# EAGLE schematic 258Verbos (EAGLE 7.5.0)
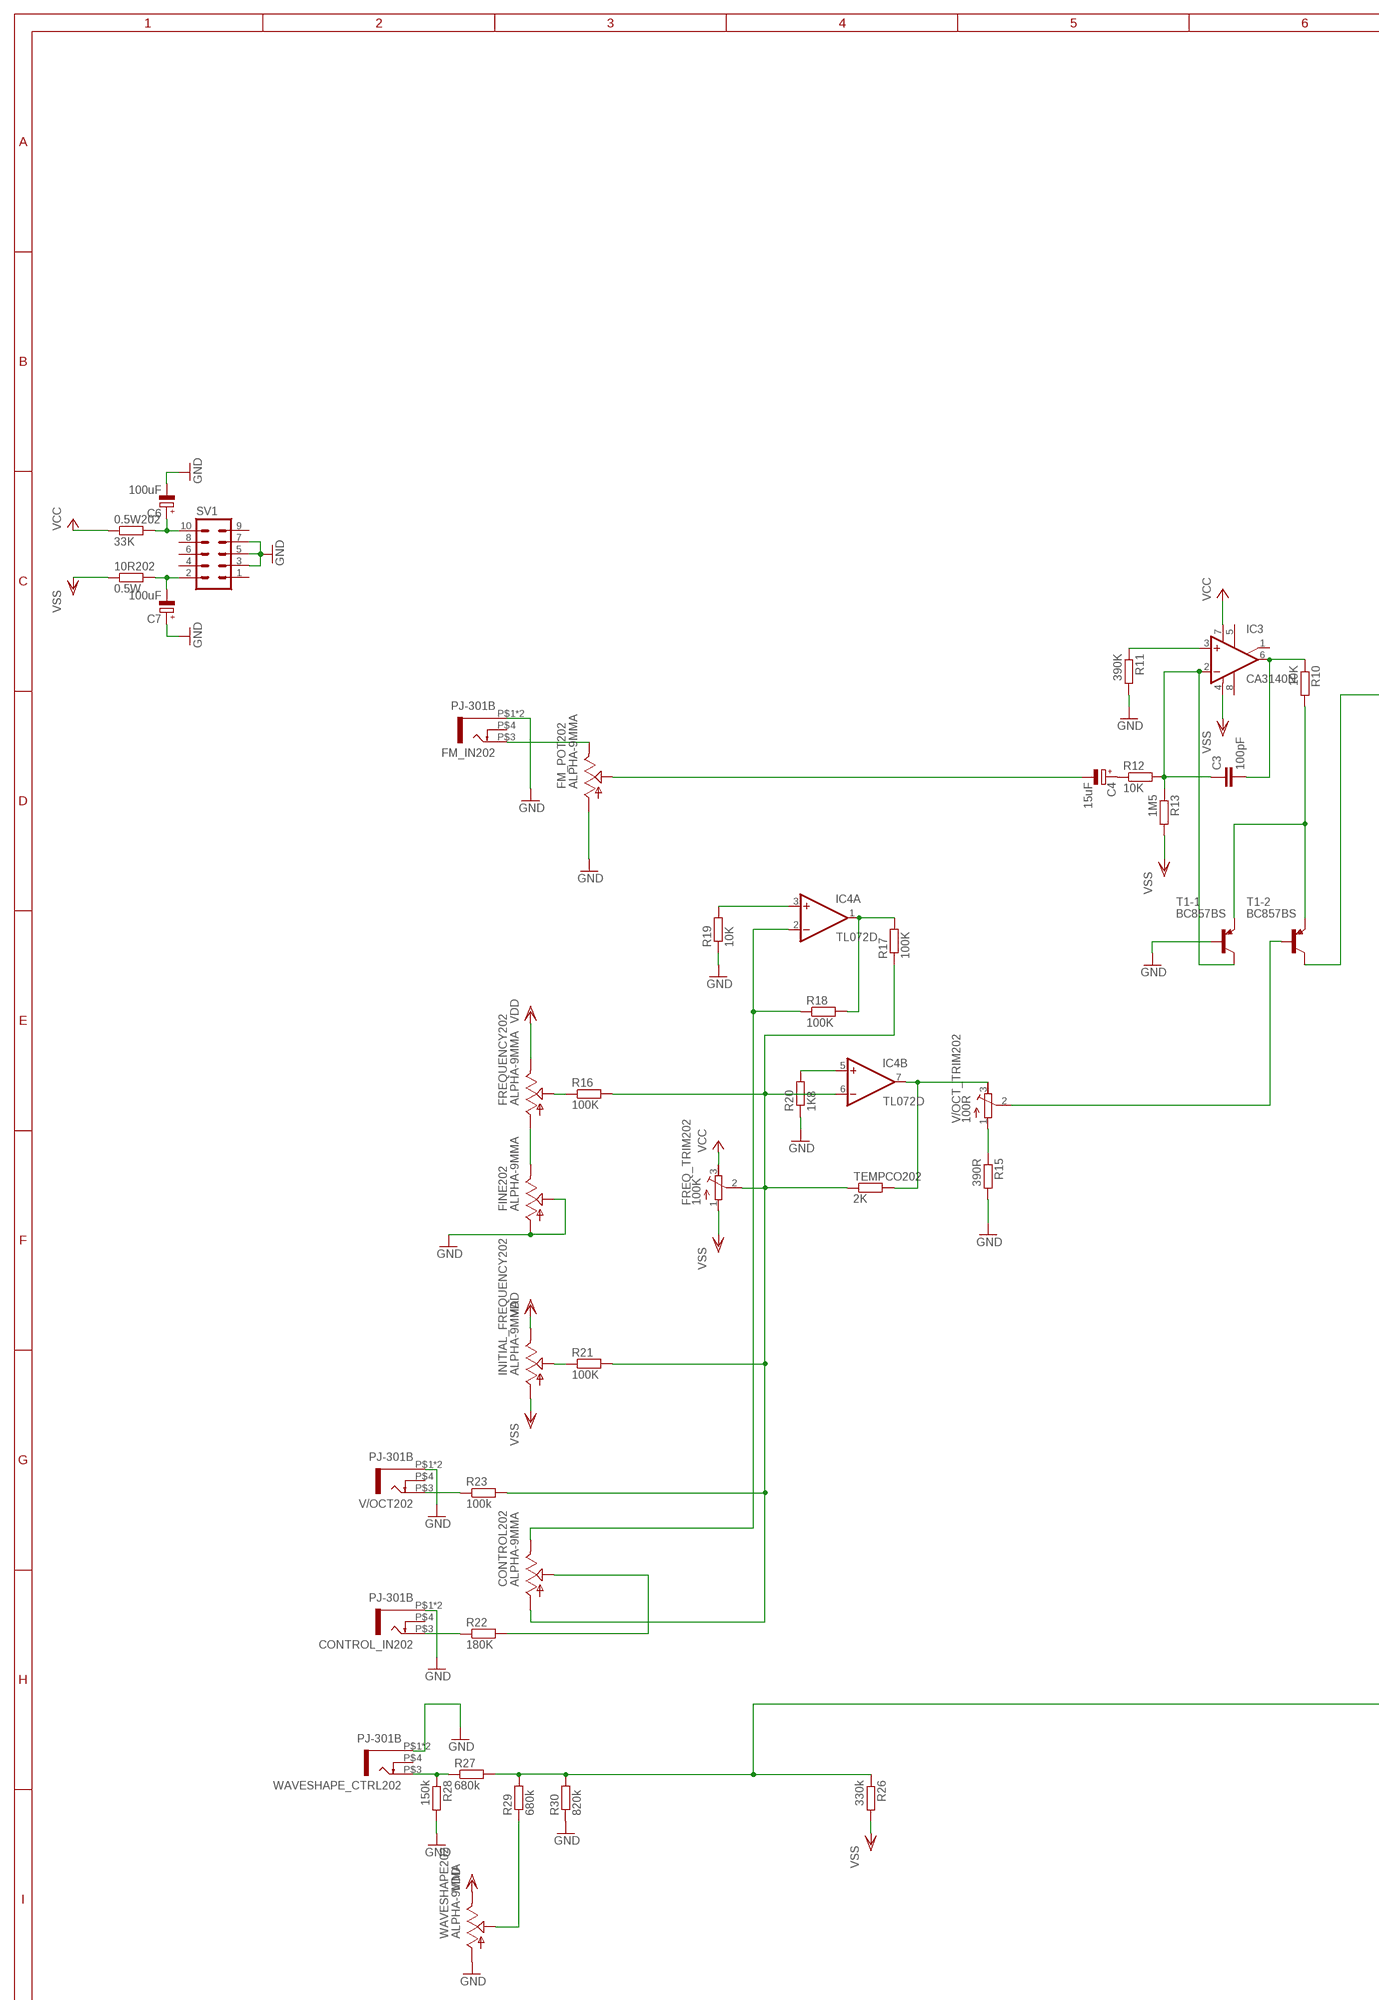
[diagram p0: schematic, sheet 1, part 1 of 2]
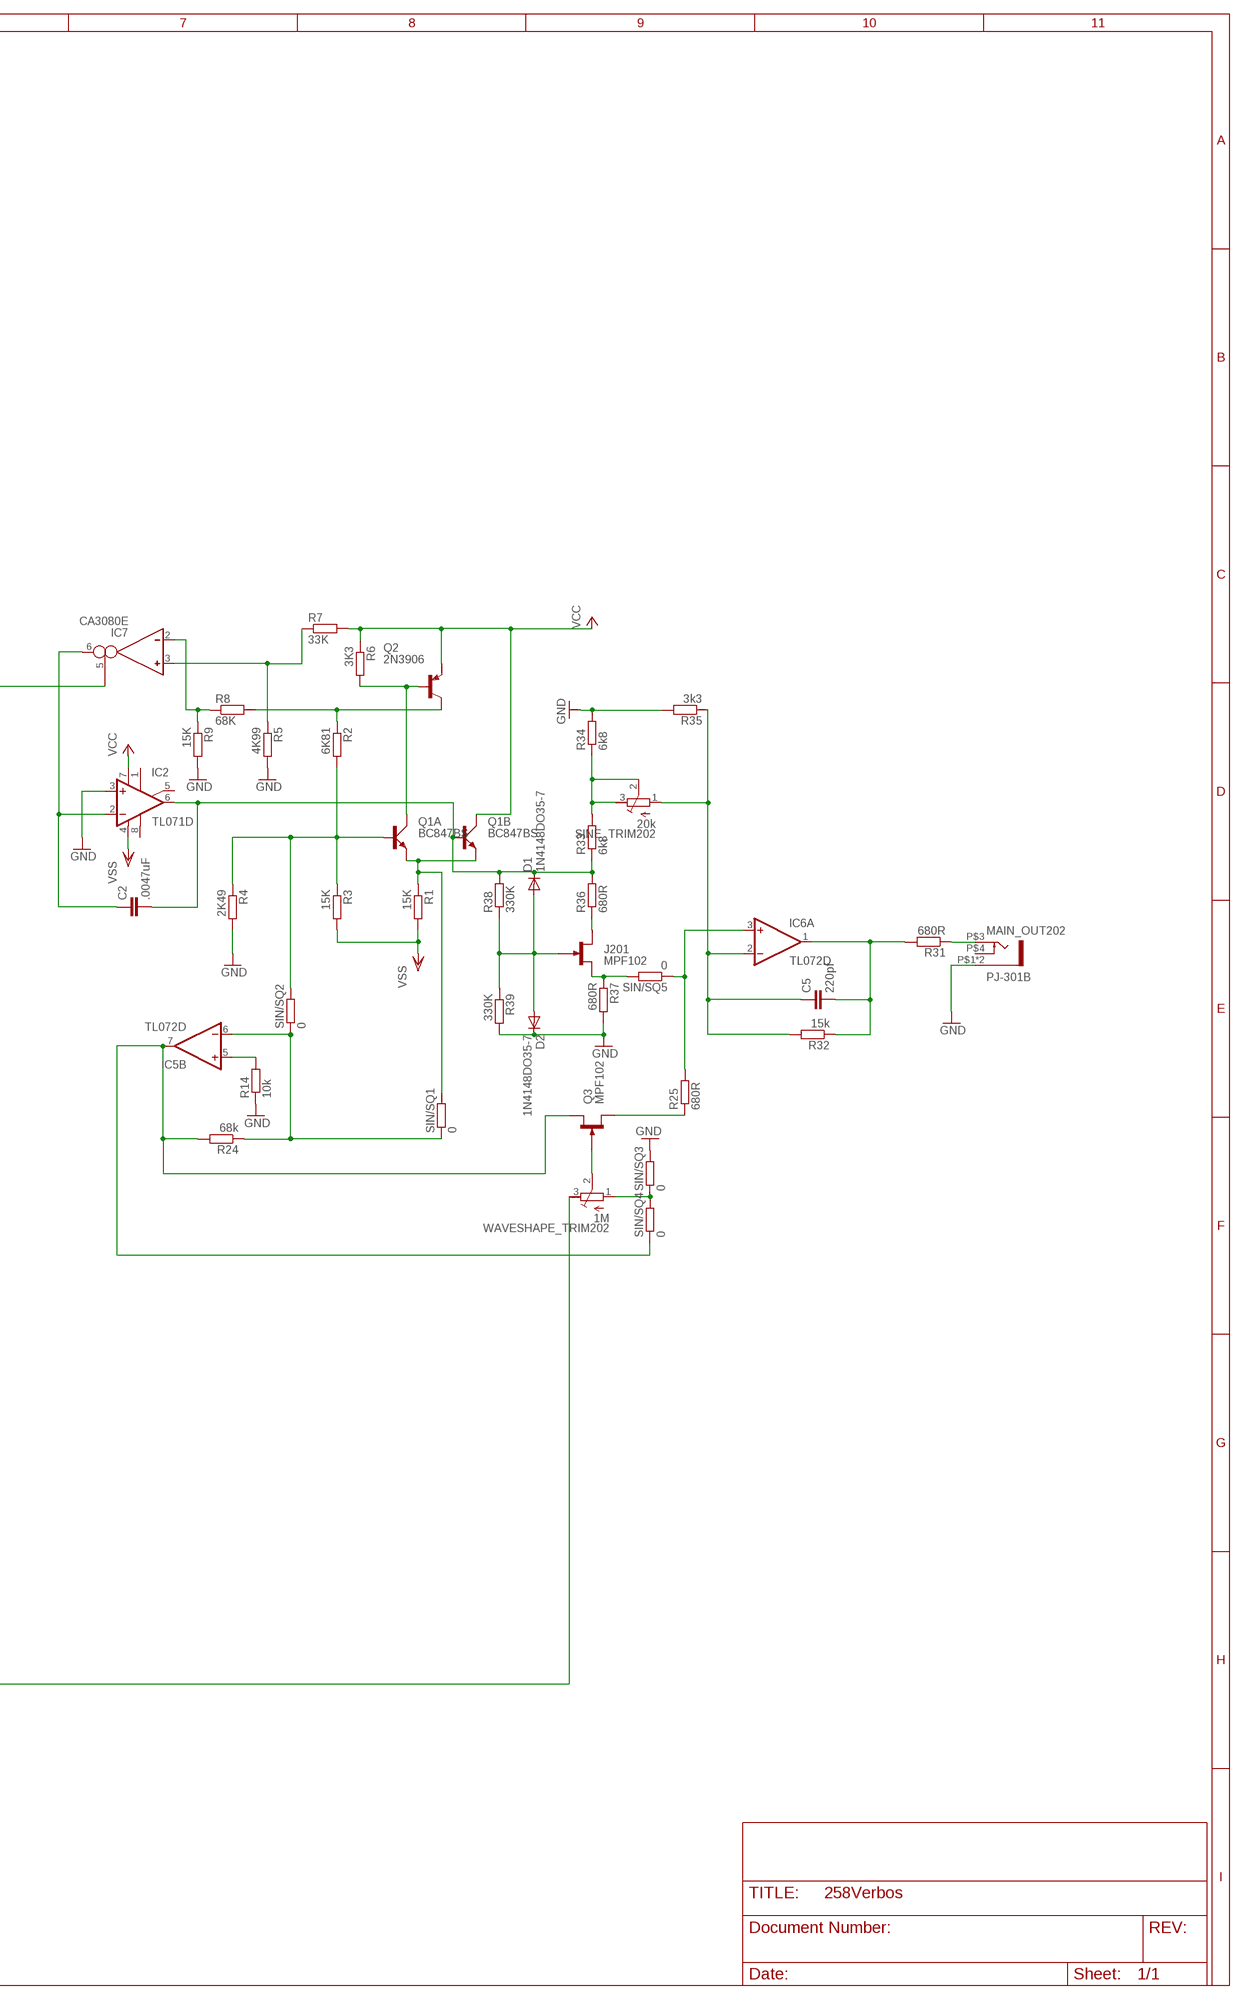
[diagram p1: schematic, sheet 1, part 2 of 2]

## Parts
0.5W202  33K  R-EU_R0805  [R0805]
10R202  0.5W  R-EU_R0805  [R0805]
C2  .0047uF  C5/4.5  [C5B4.5]
C3  100pF  C2,5-3  [C2.5-3]
C4  15uF  CPOL-EUE2,5-6E  [E2,5-6E]
C5  220pf  C2,5-3  [C2.5-3]
C6  100uF  CPOL-EUE2,5-6E  [E2,5-6E]
C7  100uF  CPOL-EUE2,5-6E  [E2,5-6E]
CONTROL202  ALPHA-9MMA  [EVUF]
CONTROL_IN202  PJ-301B  [PJ-301B]
D1  1N4148DO35-7  [DO35-7]
D2  1N4148DO35-7  [DO35-7]
FINE202  ALPHA-9MMA  [EVUF]
FM_IN202  PJ-301B  [PJ-301B]
FM_POT202  ALPHA-9MMA  [EVUF]
FREQ_TRIM202  100K  R-TRIMM64W  [RTRIM64W]
FREQUENCY202  ALPHA-9MMA  [EVUF]
IC2  TL071D  [SO08]
IC3  CA3140N  [DIL08]
IC4  TL072D  [SO08]
IC5  TL072D  [SO08]
IC6  TL072D  [SO08]
IC7  CA3080E  [DIL08]
INITIAL_FREQUENCY202  ALPHA-9MMA  [EVUF]
J201  MPF102  [TO92F]
MAIN_OUT202  PJ-301B  [PJ-301B]
Q1  BC847BS  [SOT363_PHILIPS]
Q2  2N3906  [TO92]
Q3  MPF102  [TO92F]
R1  15K  R-EU_R0805  [R0805]
R2  6K81  R-EU_R0805  [R0805]
R3  15K  R-EU_R0805  [R0805]
R4  2K49  R-EU_R0805  [R0805]
R5  4K99  R-EU_R0805  [R0805]
R6  3K3  R-EU_R0805  [R0805]
R7  33K  R-EU_R0805  [R0805]
R8  68K  R-EU_R0805  [R0805]
R9  15K  R-EU_R0805  [R0805]
R10  10K  R-EU_R0805  [R0805]
R11  390K  R-EU_R0805  [R0805]
R12  10K  R-EU_R0805  [R0805]
R13  1M5  R-EU_R0805  [R0805]
R14  10k  R-EU_R0805  [R0805]
R15  390R  R-EU_R0805  [R0805]
R16  100K  R-EU_R0805  [R0805]
R17  100K  R-EU_R0805  [R0805]
R18  100K  R-EU_R0805  [R0805]
R19  10K  R-EU_R0805  [R0805]
R20  1K8  R-EU_R0805  [R0805]
R21  100K  R-EU_R0805  [R0805]
R22  180K  R-EU_R0805  [R0805]
R23  100k  R-EU_R0805  [R0805]
R24  68k  R-EU_R0805  [R0805]
R25  680R  R-EU_R0805  [R0805]
R26  330k  R-EU_R0805  [R0805]
R27  680k  R-EU_R0805  [R0805]
R28  150k  R-EU_R0805  [R0805]
R29  680k  R-EU_R0805  [R0805]
R30  820k  R-EU_R0805  [R0805]
R31  680R  R-EU_R0805  [R0805]
R32  15k  R-EU_R0805  [R0805]
R33  6k8  R-EU_R0805  [R0805]
R34  6k8  R-EU_R0805  [R0805]
R35  3k3  R-EU_R0805  [R0805]
R36  680R  R-EU_R0805  [R0805]
R37  680R  R-EU_R0805  [R0805]
R38  330K  R-EU_R0805  [R0805]
R39  330K  R-EU_R0805  [R0805]
SIN/SQ1  0  R-EU_R0805  [R0805]
SIN/SQ2  0  R-EU_R0805  [R0805]
SIN/SQ3  0  R-EU_R0805  [R0805]
SIN/SQ4  0  R-EU_R0805  [R0805]
SIN/SQ5  0  R-EU_R0805  [R0805]
SINE_TRIM202  20k  R-TRIMM64W  [RTRIM64W]
SV1  10_PIN_HEADER  [MA05-2]
T1  BC857BS  [SOT363]
TEMPCO202  2K  R-EU_R0805  [R0805]
V/OCT202  PJ-301B  [PJ-301B]
V/OCT_TRIM202  100R  R-TRIMM64W  [RTRIM64W]
WAVESHAPE202  ALPHA-9MMA  [EVUF]
WAVESHAPE_CTRL202  PJ-301B  [PJ-301B]
WAVESHAPE_TRIM202  1M  R-TRIMM64W  [RTRIM64W]

## Nets
GND: C6.- C7.+ CONTROL_IN202.P$1 CONTROL_IN202.P$2 D2.C FINE202.1(A) FINE202.2(S) FM_IN202.P$1 FM_IN202.P$2 FM_POT202.1(A) IC2.3(+IN) MAIN_OUT202.P$1 MAIN_OUT202.P$2 R4.2 R5.2 R9.2 R11.2 R14.1 R15.2 R19.1 R20.1 R28.2 R30.1 R34.2 R35.2 R37.2 R39.2 SIN/SQ3.2 SV1.3 SV1.5 SV1.7 T1.2(-1:B) V/OCT202.P$1 V/OCT202.P$2 WAVESHAPE202.1(A) WAVESHAPE_CTRL202.P$1 WAVESHAPE_CTRL202.P$2
N$1: Q1.1(A:E) Q1.4(B:E) R1.1 SIN/SQ1.2
N$2: Q1.6(A:C) Q2.2(B) R6.2
N$3: Q2.1(C) R2.1 R8.2
N$4: Q1.2(A:B) R2.2 R3.1 R4.1 SIN/SQ2.2
N$5: J201.1(D) R36.1
N$6: C2.1 IC2.2(-IN) IC7.6(OUT)
N$7: IC7.3(IN_P) R5.1 R7.1
N$9: IC7.2(IN_N) R8.1 R9.1
N$10: R10.2 T1.1(-1:E) T1.4(-2:E)
N$11: C3.2 IC3.6(OUT) R10.1
N$12: C3.1 IC3.2(-IN) R12.2 R13.1 T1.6(-1:C)
N$13: IC3.3(+IN) R11.1
N$14: C4.+ R12.1
N$15: T1.5(-2:B) V/OCT_TRIM202.2(S)
N$16: R15.1 V/OCT_TRIM202.1(A)
N$17: IC4.7(B:OUT) TEMPCO202.2 V/OCT_TRIM202.3(E)
N$18: CONTROL202.1(A) FREQ_TRIM202.2(S) IC4.6(B:-IN) R16.2 R17.1 R21.2 R23.2 TEMPCO202.1
N$19: IC4.1(A:OUT) R17.2 R18.2
N$20: CONTROL202.3(E) IC4.2(A:-IN) R18.1
N$21: IC4.3(A:+IN) R19.2
N$22: IC4.5(B:+IN) R20.2
N$23: C4.- FM_POT202.2(S)
N$24: FREQUENCY202.2(S) R16.1
N$25: IC7.5(I_BIAS) T1.3(-2:C)
N$26: INITIAL_FREQUENCY202.2(S) R21.1
N$27: FM_IN202.P$3 FM_POT202.3(E)
N$28: CONTROL_IN202.P$3 R22.1
N$29: CONTROL202.2(S) R22.2
N$30: R23.1 V/OCT202.P$3
N$31: IC5.5(B:+IN) R14.2
N$32: IC5.6(B:-IN) R24.1 SIN/SQ1.1 SIN/SQ2.1
N$33: IC5.7(B:OUT) Q3.1(D) R24.2 SIN/SQ4.1
N$34: C5.2 IC6.1(A:OUT) R31.2 R32.1
N$35: Q3.2(S) R25.1
N$36: IC6.3(A:+IN) R25.2 SIN/SQ5.1
N$37: Q3.3(G) WAVESHAPE_TRIM202.2(S)
N$38: SIN/SQ3.1 SIN/SQ4.2 WAVESHAPE_TRIM202.1(A)
N$39: R27.1 R28.1 WAVESHAPE_CTRL202.P$3
N$40: R26.1 R27.2 R29.2 R30.2 WAVESHAPE_TRIM202.3(E)
N$41: R29.1 WAVESHAPE202.2(S)
N$42: MAIN_OUT202.P$3 R31.1
N$43: C5.1 IC6.2(A:-IN) R32.2 R35.1 SINE_TRIM202.1(A)
N$44: R33.2 R34.1 SINE_TRIM202.2(S) SINE_TRIM202.3(E)
N$46: D1.A D2.A J201.3(G) R38.1 R39.1
N$47: C2.2 D1.C IC2.6(OUT) Q1.5(B:B) R33.1 R36.2 R38.2
N$49: J201.2(S) R37.1 SIN/SQ5.2
N$51: 0.5W202.2 C6.+ SV1.10
N$52: 10R202.2 C7.- SV1.2
N$54: FINE202.3(E) FREQUENCY202.1(A)
VCC: 0.5W202.1 FREQ_TRIM202.3(E) IC2.7(V+) IC3.7(V+) Q1.3(B:C) Q2.3(E) R6.1 R7.2
VDD: FREQUENCY202.3(E) INITIAL_FREQUENCY202.3(E) WAVESHAPE202.3(E)
VSS: 10R202.1 FREQ_TRIM202.1(A) IC2.4(V-) IC3.4(V-) INITIAL_FREQUENCY202.1(A) R1.2 R3.2 R13.2 R26.2
Unconnected: CONTROL_IN202.P$4 FM_IN202.P$4 IC2.1(ON1) IC2.5(ON2) IC2.8(OPT) IC3.1(ON/CMP) IC3.5(ON) IC3.8(CMP) IC5.1(A:OUT) IC5.2(A:-IN) IC5.3(A:+IN) IC6.5(B:+IN) IC6.6(B:-IN) IC6.7(B:OUT) IC7.4(V-) IC7.7(V+) MAIN_OUT202.P$4 SV1.1 SV1.4 SV1.6 SV1.8 SV1.9 V/OCT202.P$4 WAVESHAPE_CTRL202.P$4

## Power pins joined to a net without a drawn wire
V+: IC4.8(P:V+) IC5.8(P:V+) IC6.8(P:V+)
V-: IC4.4(P:V-) IC5.4(P:V-) IC6.4(P:V-)

## Library data of the parts
0.5W202 10R202 R1-R39 SIN/SQ1-SIN/SQ5 TEMPCO202 = resistor:R-EU_: RESISTOR, European symbol
C2 C3 C5 = capacitor-wima:C: CAPACITOR naming: grid - package width
C4 C6 C7 = resistor:CPOL-EU: POLARIZED CAPACITOR, European symbol
CONTROL202 FINE202 FM_POT202 FREQUENCY202 INITIAL_FREQUENCY202 WAVESHAPE202 = TomW:ALPHA-9MM: 9 mm Square Rotary Potentiometers Source: Panasonic
CONTROL_IN202 FM_IN202 MAIN_OUT202 V/OCT202 WAVESHAPE_CTRL202 = TomW:PJ-301B
D1 D2 = diode:1N4148: DIODE high speed (Philips)
FREQ_TRIM202 SINE_TRIM202 V/OCT_TRIM202 WAVESHAPE_TRIM202 = rcl:R-TRIMM: Trimm resistor
IC2 = linear:TL071: OP AMP
IC3 = linear:CA3140: OP AMP
IC4-IC6 = linear:TL072: OP AMP
IC7 = ota:CA3080: OTA
J201 Q3 = bt_transistor:MPF102: JFET VHF Amplifier Small signal transistor. N-channel depletion FET
Q1 = transistor-small-signal:BC847BS: NPN general purpose double transistor Source: http://www.farnell.com/datasheets/2466.pdf
Q2 = transistor-pnp:2N3906: PNP Transistor
SV1 = TomW:10_PIN_HEADER: PIN HEADER; OC_FARNELL: unknown; OC_NEWARK: unknown
T1 = nxp_60:BC857BS: PNP double transistor in an SC-88; SOT363 plastic package. AAL Eindhoven MK